# EAGLE design AmiExtFDD (EAGLE 5.09)
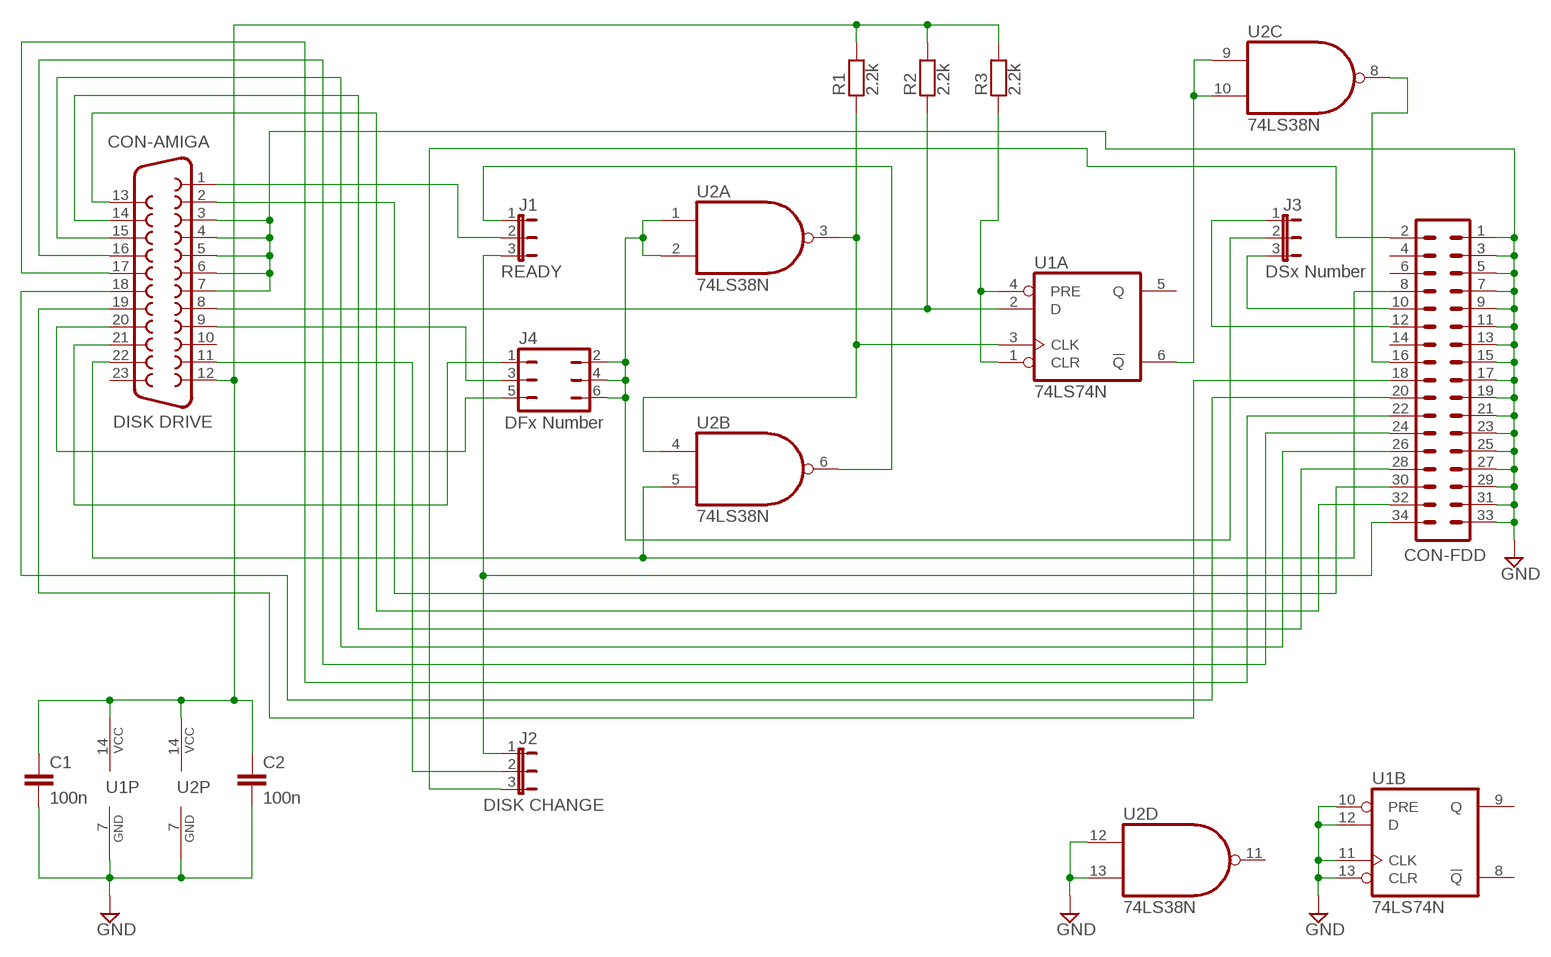
[diagram p0: schematic, sheet 1]

## Parts
C1  100n  PAD-C7.5  [PAD-C7.5]
C2  100n  PAD-C7.5  [PAD-C7.5]
CON-AMIGA  DISK DRIVE  DB23  [DB23]
CON-FDD  FDD  [FDD]
J1  READY  PAD-JP3X1  [PAD-JP3X1]
J2  DISK CHANGE  PAD-JP3X1  [PAD-JP3X1]
J3  DSx Number  PAD-JP3X1  [PAD-JP3X1]
J4  DFx Number  PAD-JP3X2  [PAD-JP3X2]
R1  2.2k  PAD-R10  [PAD-R10]
R2  2.2k  PAD-R10  [PAD-R10]
R3  2.2k  PAD-R10  [PAD-R10]
U1  74LS74N  PAD-7474  [PAD-7474]
U2  74LS38N  PAD-7438  [PAD-7438]

## Nets
GND: C1.2 C2.2 CON-AMIGA.3 CON-AMIGA.4 CON-AMIGA.5 CON-AMIGA.6 CON-AMIGA.7 CON-FDD.1 CON-FDD.3 CON-FDD.5 CON-FDD.7 CON-FDD.9 CON-FDD.11 CON-FDD.13 CON-FDD.15 CON-FDD.17 CON-FDD.19 CON-FDD.21 CON-FDD.23 CON-FDD.25 CON-FDD.27 CON-FDD.29 CON-FDD.31 CON-FDD.33 U1.7(P:GND) U1.10(B:PRE) U1.11(B:CLK) U1.12(B:D) U1.13(B:CLR) U2.7(P:GND) U2.12(D:I0) U2.13(D:I1)
N$1: CON-AMIGA.11 J2.2
N$3: CON-FDD.16 U2.8(C:O)
N$4: U1.6(A:!Q) U2.9(C:I0) U2.10(C:I1)
N$9: CON-FDD.34 J1.3 J2.1
N$11: CON-FDD.2 J2.3
N$12: J1.1 U2.6(B:O)
N$13: CON-AMIGA.1 J1.2
N$14: CON-AMIGA.21 J4.1
N$15: CON-AMIGA.9 J4.3
N$16: CON-FDD.12 J3.1
N$17: CON-AMIGA.20 J4.5
N$19: J3.2 J4.2 J4.4 J4.6 U2.1(A:I0) U2.2(A:I1)
N$20: R1.1 U1.3(A:CLK) U2.3(A:O) U2.4(B:I0)
N$21: CON-AMIGA.22 CON-FDD.8 U2.5(B:I1)
N$22: CON-FDD.10 J3.3
N$23: CON-AMIGA.2 CON-FDD.30
N$24: CON-AMIGA.8 R2.1 U1.2(A:D)
N$25: C1.1 C2.1 CON-AMIGA.12 R1.2 R2.2 R3.2 U1.14(P:VCC) U2.14(P:VCC)
N$26: CON-AMIGA.14 CON-FDD.28
N$27: CON-AMIGA.15 CON-FDD.26
N$28: CON-AMIGA.13 CON-FDD.32
N$29: CON-AMIGA.16 CON-FDD.24
N$30: CON-AMIGA.17 CON-FDD.22
N$31: CON-AMIGA.18 CON-FDD.20
N$32: CON-AMIGA.19 CON-FDD.18
N$33: R3.1 U1.1(A:CLR) U1.4(A:PRE)
Unconnected: CON-AMIGA.10 CON-AMIGA.23 CON-FDD.4 CON-FDD.6 CON-FDD.14 U1.5(A:Q) U1.8(B:!Q) U1.9(B:Q) U2.11(D:O)

## Library data of the parts
C1 C2 = _my:PAD-C7.5
CON-AMIGA = _my:DB23
CON-FDD = _my:FDD
J1-J3 = _my:PAD-JP3X1
J4 = _my:PAD-JP3X2
R1-R3 = _my:PAD-R10
U1 = _my:PAD-7474
U2 = _my:PAD-7438

## Board
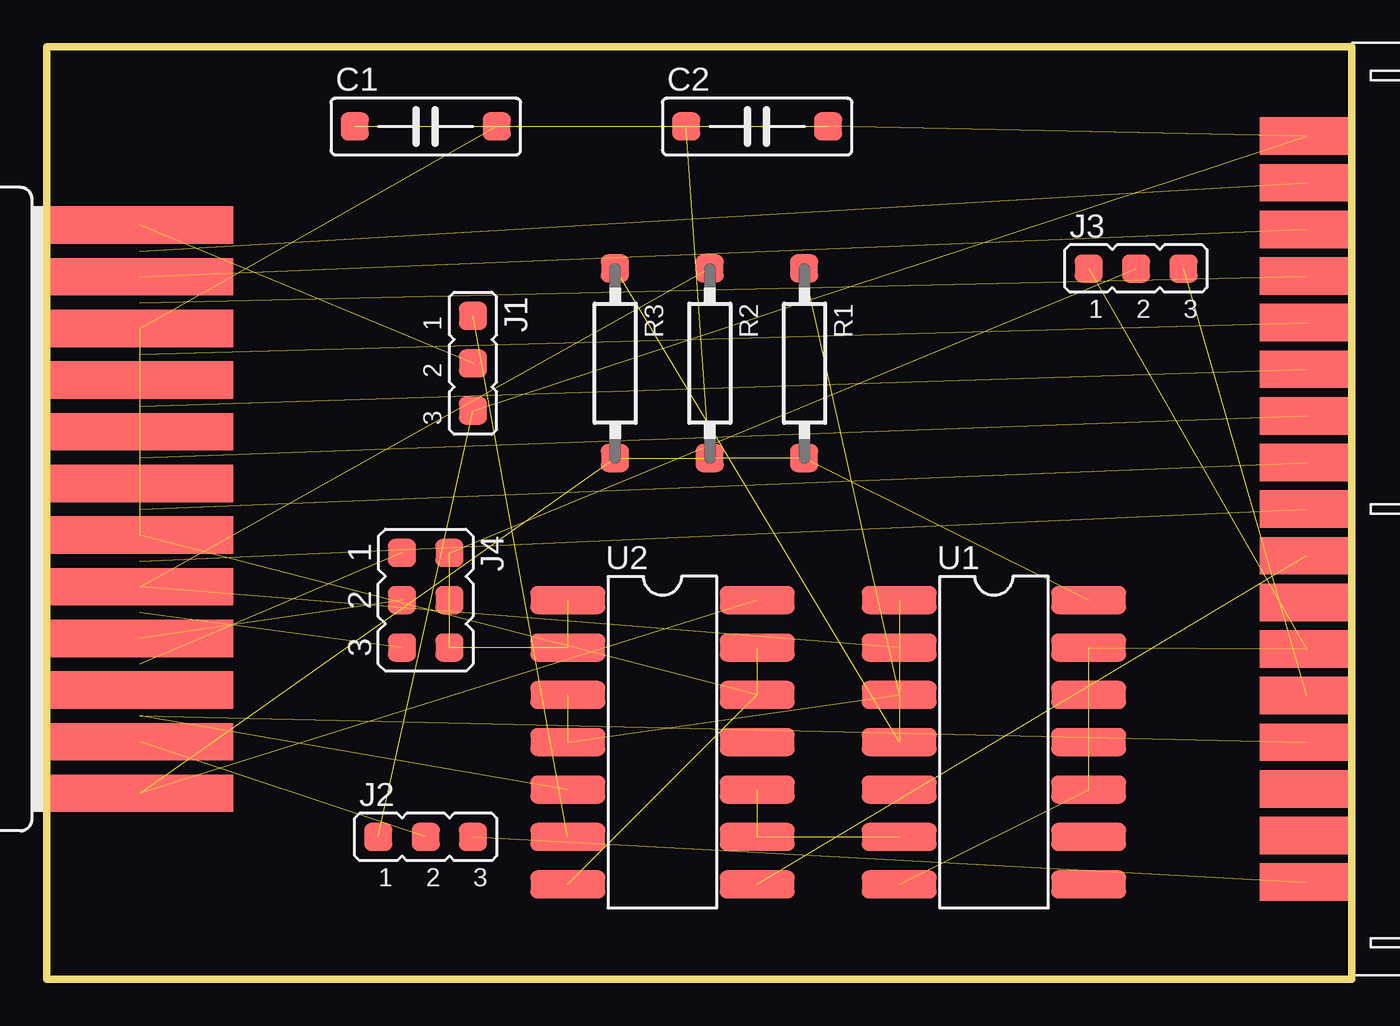
[diagram p1: board, top side]
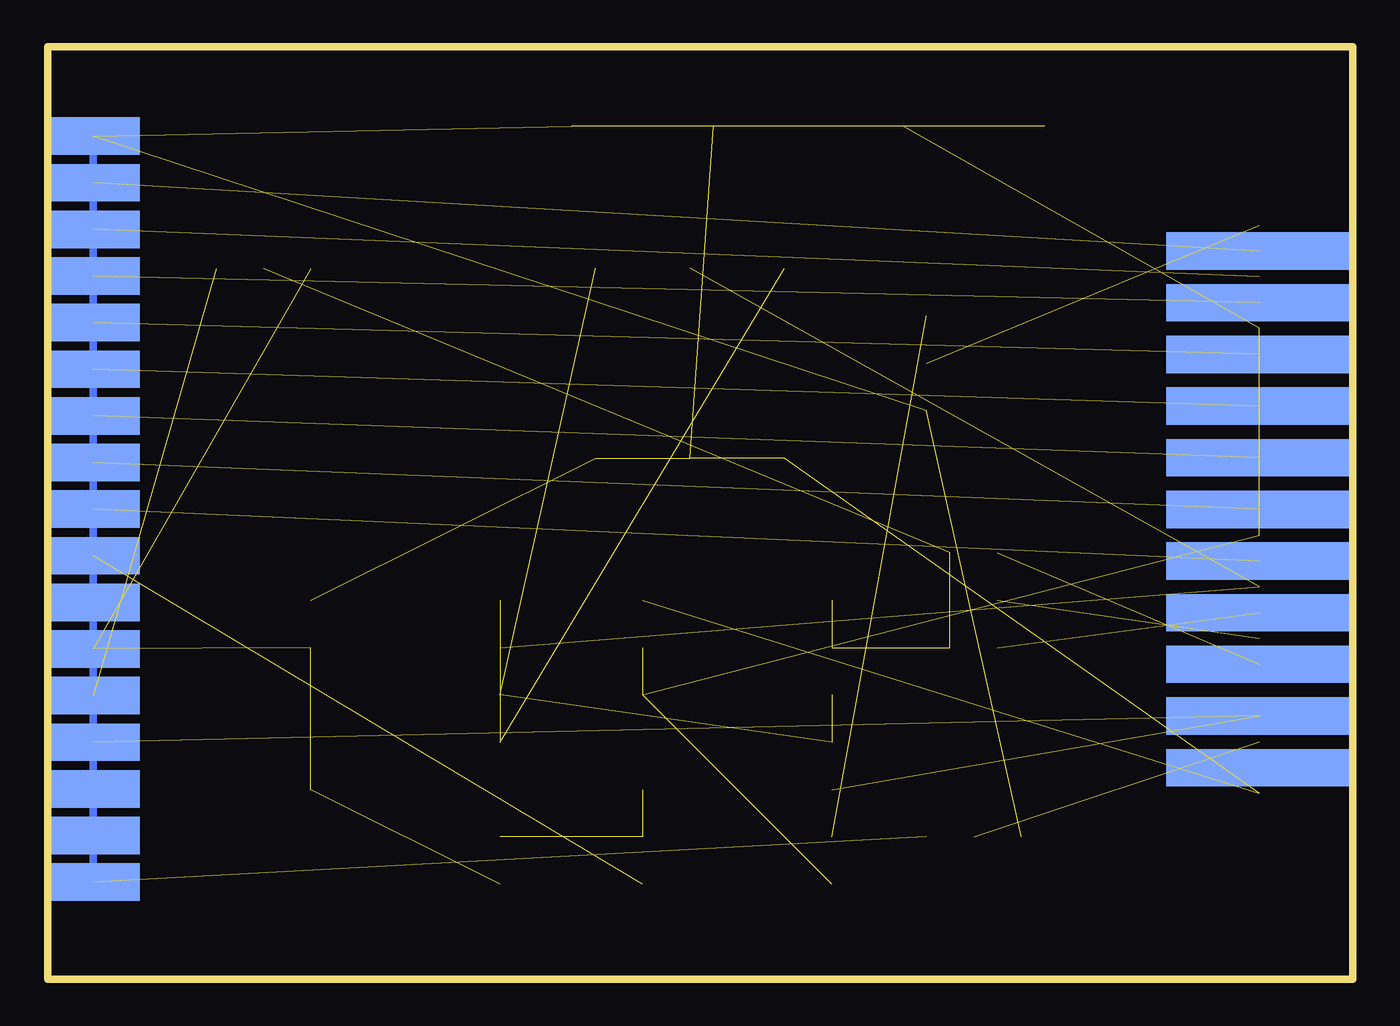
[diagram p2: board, bottom side, seen from below]

Size 70 x 50 mm. Coordinates in mm from the lower left corner, seen from the top.
Outline: 0,50 0,0 70,0 70,50 0,50
Copper layers (1*16): Top 0.035mm / dielectric 0.83mm / Bottom 0.035mm
Design rules "_my": minimum track width 1mm, minimum drill 24mil, track to track 1mm, track to pad 1mm, pad to pad 1mm, via to via 1mm, smd to smd 1mm, copper to edge 0mil, drill to drill 8mil, minimum pad ring 10mil, minimum via ring 8mil, stop-mask expansion 4mil, vias tented up to drill 0mil, thermal gap 10mil

### Footprints (pad centres in the part's own frame; a part is rotated, then mirrored left to right if it is on the bottom)
PAD-C7.5 = smd 1.5 x 1.5: 1 -3.81,0; 2 3.81,0
DB23 = smd 2 x 10: 1 15.23,-9.6; 2 12.46,-9.6; 3 9.69,-9.6; 4 6.92,-9.6; 5 4.15,-9.6; 6 1.38,-9.6; 7 -1.39,-9.6; 8 -4.16,-9.6; 9 -6.93,-9.6; 10 -9.7,-9.6; 11 -12.47,-9.6; 12 -15.24,-9.6 | smd 2 x 10 bottom: 13 13.838,-9.585; 14 11.068,-9.585; 15 8.298,-9.585; 16 5.528,-9.585; 17 2.758,-9.585; 18 -0.012,-9.585; 19 -2.782,-9.585; 20 -5.552,-9.585; 21 -8.322,-9.585; 22 -11.092,-9.585; 23 -13.862,-9.585
FDD = smd 2 x 5 bottom: 1 20,-6.465; 3 17.5,-6.465; 5 15,-6.465; 7 12.5,-6.465; 9 10,-6.465; 11 7.5,-6.465; 13 5,-6.465; 15 2.5,-6.465; 17 0,-6.465; 19 -2.5,-6.465; 21 -5,-6.465; 23 -7.5,-6.465; 25 -10,-6.465; 27 -12.5,-6.465; 29 -15,-6.465; 31 -17.5,-6.465; 33 -20,-6.465 | smd 2 x 5: 2 20,-6.465; 4 17.5,-6.465; 6 15,-6.465; 8 12.5,-6.465; 10 10,-6.465; 12 7.5,-6.465; 14 5,-6.465; 16 2.5,-6.465; 18 0,-6.465; 20 -2.5,-6.465; 22 -5,-6.465; 24 -7.5,-6.465; 26 -10,-6.465; 28 -12.5,-6.465; 30 -15,-6.465; 32 -17.5,-6.465; 34 -20,-6.465
PAD-JP3X1 = smd 1.5 x 1.5: 1 -2.54,0; 2 0,0; 3 2.54,0
PAD-JP3X2 = smd 1.5 x 1.5: 1 -2.54,-1.27; 2 -2.54,1.27; 3 0,-1.27; 4 0,1.27; 5 2.54,-1.27; 6 2.54,1.27
PAD-R10 = smd 1.5 x 1.5: 1 -5.096,-0.017; 2 5.079,-0.017
PAD-7474 = smd 1.5 x 4: 1 -7.62,-5.08; 2 -5.08,-5.08; 3 -2.54,-5.08; 4 0,-5.08; 5 2.54,-5.08; 6 5.08,-5.08; 7 7.62,-5.08; 8 7.62,5.08; 9 5.08,5.08; 10 2.54,5.08; 11 0,5.08; 12 -2.54,5.08; 13 -5.08,5.08; 14 -7.62,5.08
PAD-7438 = smd 1.5 x 4: 1 -7.62,-5.08; 2 -5.08,-5.08; 3 -2.54,-5.08; 4 0,-5.08; 5 2.54,-5.08; 6 5.08,-5.08; 7 7.62,-5.08; 8 7.62,5.08; 9 5.08,5.08; 10 2.54,5.08; 11 0,5.08; 12 -2.54,5.08; 13 -5.08,5.08; 14 -7.62,5.08

### Placement (x,y rotation side)
C1  20.32,45.72 0 top
C2  38.1,45.72 0 top
CON-AMIGA  -4.6,25.2 90 top
CON-FDD  74.02,25.2 270 top
J1  22.86,33.02 270 top
J2  20.32,7.62 0 top
J3  58.42,38.1 0 top
J4  20.32,20.32 270 top
R1  40.64,33.02 270 top
R2  35.56,33.02 270 top
R3  30.48,33.02 270 top
U1  50.8,12.7 270 top
U2  33.02,12.7 270 top

### Tracks (layer width: path | path; a pad name or v marks a point on that pad's centre or on a via)
GND  (15 unrouted)
  Bottom 0.406: CON-FDD.1 CON-FDD.3 CON-FDD.5 CON-FDD.7 CON-FDD.9 CON-FDD.15 | CON-FDD.11 CON-FDD.13 CON-FDD.15 | CON-FDD.33 CON-FDD.31 | CON-FDD.33 CON-FDD.29 | CON-FDD.33 CON-FDD.27 | CON-FDD.33 CON-FDD.25 | CON-FDD.33 CON-FDD.23 | CON-FDD.33 CON-FDD.21 | CON-FDD.33 CON-FDD.19 | CON-FDD.33 CON-FDD.17 | CON-FDD.15 CON-FDD.33
N$1  (1 unrouted)
N$3  (1 unrouted)
N$4  (2 unrouted)
N$9  (2 unrouted)
N$11  (1 unrouted)
N$12  (1 unrouted)
N$13  (1 unrouted)
N$14  (1 unrouted)
N$15  (1 unrouted)
N$16  (1 unrouted)
N$17  (1 unrouted)
N$19  (5 unrouted)
N$20  (3 unrouted)
N$21  (2 unrouted)
N$22  (1 unrouted)
N$23  (1 unrouted)
N$24  (2 unrouted)
N$25  (7 unrouted)
N$26  (1 unrouted)
N$27  (1 unrouted)
N$28  (1 unrouted)
N$29  (1 unrouted)
N$30  (1 unrouted)
N$31  (1 unrouted)
N$32  (1 unrouted)
N$33  (2 unrouted)